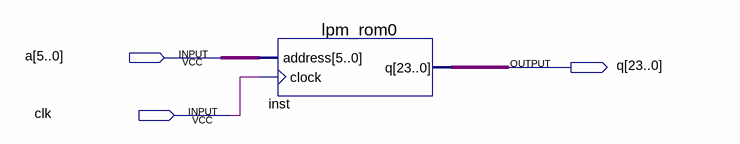
[diagram p0: schematic sheet]
// Quartus schematic rom.bdf as structural Verilog: 1 symbols, 3 pins
module rom (
  input  [5:0] a,
  input  clk,
  output [23:0] q
);

  lpm_rom0 inst (.address(a), .clock(clk), .q(q));
endmodule
